# EAGLE schematic Sensor Board Layout (EAGLE 6.5.0)
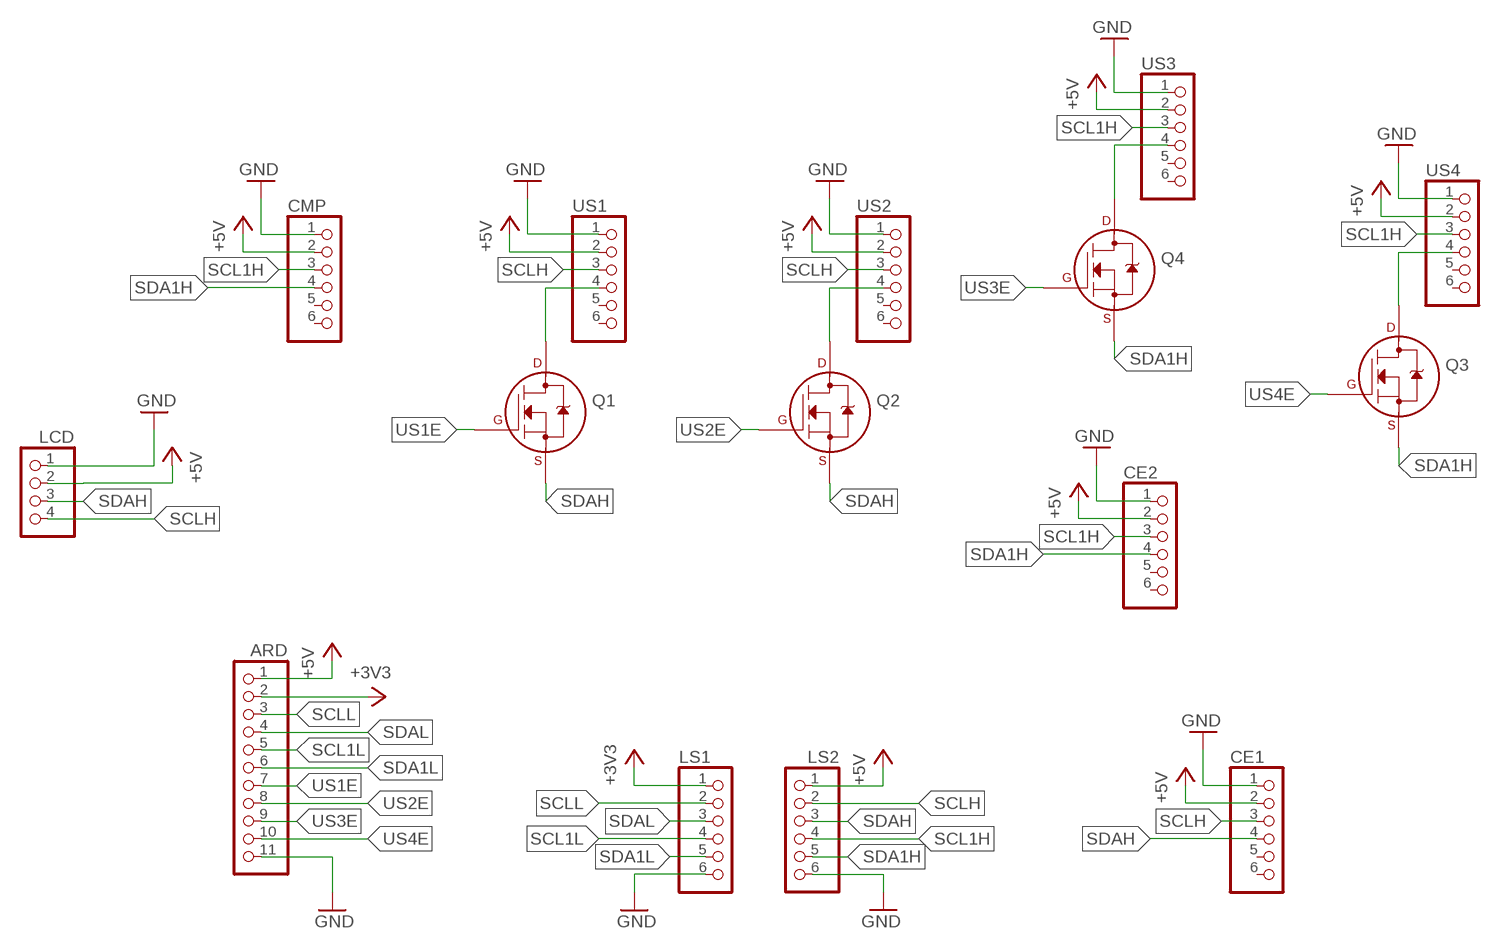
[diagram p0: schematic, sheet 1]

## Parts
ARD  PINHD-1X11  [1X11]
CE1  PINHD-1X6  [1X06]
CE2  PINHD-1X6  [1X06]
CMP  PINHD-1X6  [1X06]
LCD  PINHD-1X4  [1X04]
LS1  PINHD-1X6  [1X06]
LS2  PINHD-1X6  [1X06]
Q1  2N7000_TO92  [TO-92]
Q2  2N7000_TO92  [TO-92]
Q3  2N7000_TO92  [TO-92]
Q4  2N7000_TO92  [TO-92]
US1  PINHD-1X6  [1X06]
US2  PINHD-1X6  [1X06]
US3  PINHD-1X6  [1X06]
US4  PINHD-1X6  [1X06]

## Nets
+3V3: ARD.2 LS1.1
+5V: ARD.1 CE1.2 CE2.2 CMP.2 LCD.2 LS2.1 US1.2 US2.2 US3.2 US4.2
GND: ARD.11 CE1.1 CE2.1 CMP.1 LCD.1 LS1.6 LS2.6 US1.1 US2.1 US3.1 US4.1
N$1: Q1.3(D) US1.4
N$2: Q2.3(D) US2.4
N$3: Q3.3(D) US4.4
N$4: Q4.1(S)
N$5: Q4.3(D) US3.4
SCL1H: CE2.3 CMP.3 LS2.4 US3.3 US4.3
SCL1L: ARD.5 LS1.4
SCLH: CE1.3 LCD.4 LS2.2 US1.3 US2.3
SCLL: ARD.3 LS1.2
SDA1H: CE2.4 CMP.4 LS2.5 Q3.1(S)
SDA1L: ARD.6 LS1.5
SDAH: CE1.4 LCD.3 LS2.3 Q1.1(S) Q2.1(S)
SDAL: ARD.4 LS1.3
US1E: ARD.7 Q1.2(G)
US2E: ARD.8 Q2.2(G)
US3E: ARD.9 Q4.2(G)
US4E: ARD.10 Q3.2(G)
Unconnected: CE1.5 CE1.6 CE2.5 CE2.6 CMP.5 CMP.6 US1.5 US1.6 US2.5 US2.6 US3.5 US3.6 US4.5 US4.6

## Library data of the parts
ARD = pinhead:PINHD-1X11: PIN HEADER
CE1 CE2 CMP LS1 LS2 US1-US4 = pinhead:PINHD-1X6: PIN HEADER
LCD = pinhead:PINHD-1X4: PIN HEADER
Q1-Q4 = transistors:2N700*: 2N7000, 2N7002, NDS7002A N-channel enhancement mode MOSFET

## Net classes
0 default: width 0.381 mm, drill 0.508 mm, clearance 0.381 mm